# Altium schematic sheet Knapper og leds.SchDoc
size A4; SheetNumber: 1; SheetTotal: 1
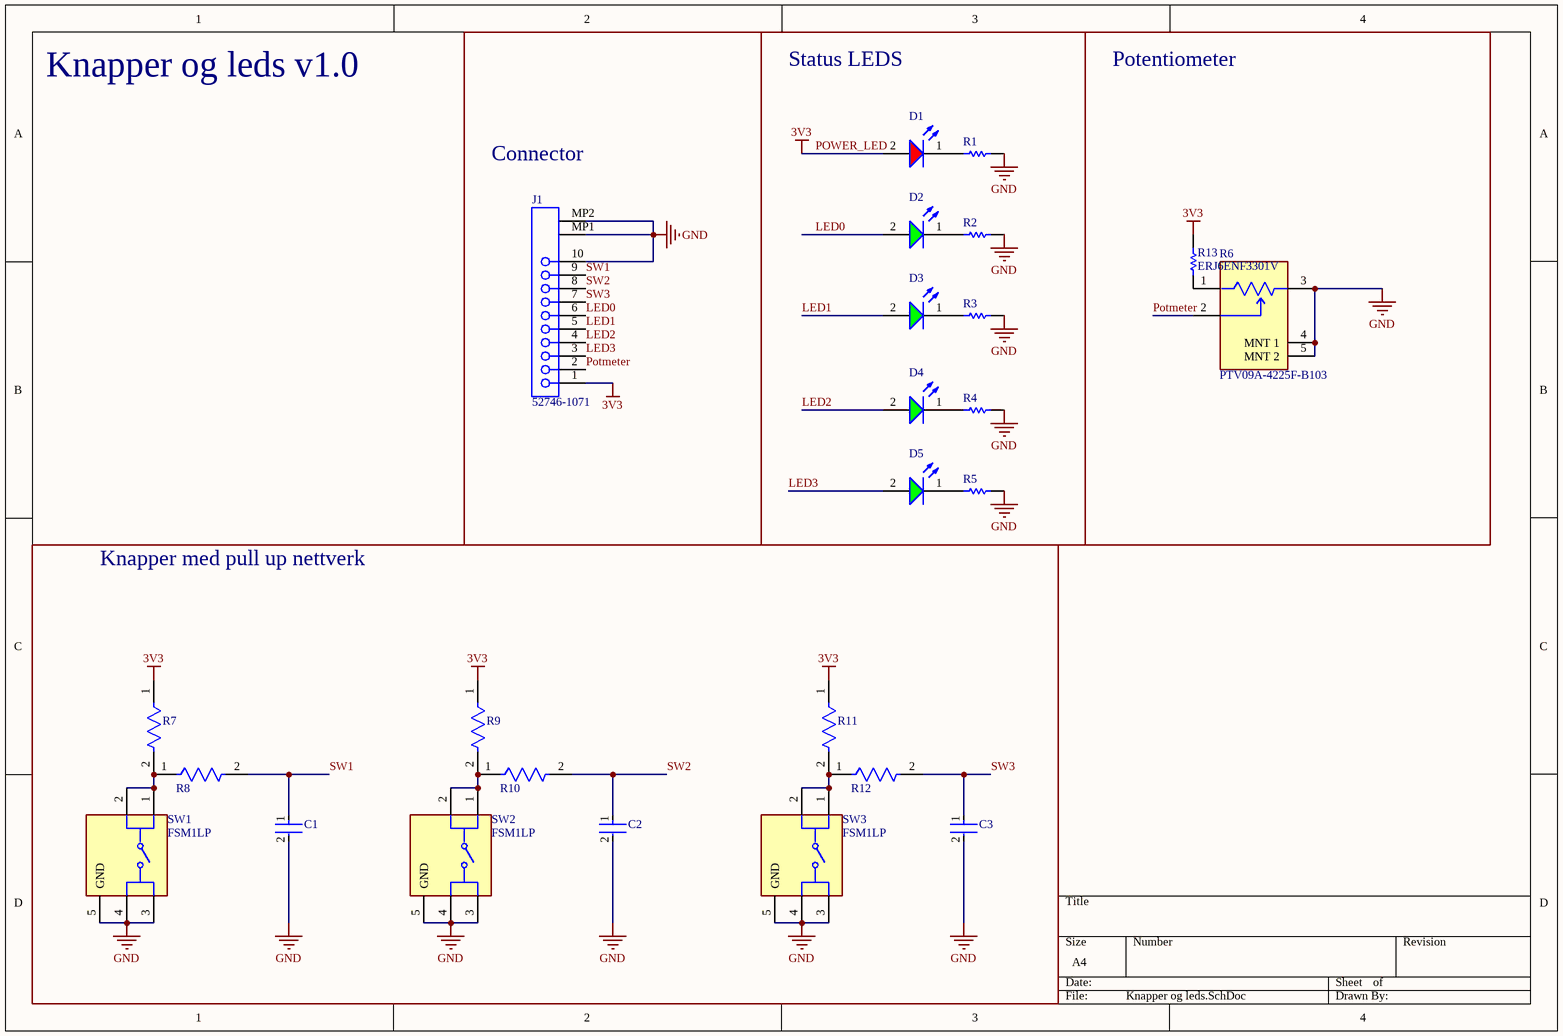
[diagram p0: Knapper og leds.SchDoc]

## Parts
C1  CC0805KRX7R7BB104  [FP-CC0805-0_85-MFG]  (value not drawn)
C2  CC0805KRX7R7BB104  [FP-CC0805-0_85-MFG]  (value not drawn)
C3  CC0805KRX7R7BB104  [FP-CC0805-0_85-MFG]  (value not drawn)
D1  150080SS75000  [WL-SMCW_0805_150080xx75000]  (value not drawn)
D2  150080VS75000  [WL-SMCW_0805_150080xx75000]  (value not drawn)
D3  150080VS75000  [WL-SMCW_0805_150080xx75000]  (value not drawn)
D4  150080VS75000  [WL-SMCW_0805_150080xx75000]  (value not drawn)
D5  150080VS75000  [WL-SMCW_0805_150080xx75000]  (value not drawn)
J1  52746-1071  [MOLX-52746-1071]
R1  ERJ6ENF56R0V  [RESC2013X70X40NL20T20]  (value not drawn)
R2  ERJ6ENF56R0V  [RESC2013X70X40NL20T20]  (value not drawn)
R3  ERJ6ENF56R0V  [RESC2013X70X40NL20T20]  (value not drawn)
R4  ERJ6ENF56R0V  [RESC2013X70X40NL20T20]  (value not drawn)
R5  ERJ6ENF56R0V  [RESC2013X70X40NL20T20]  (value not drawn)
R6  PTV09A-4225F-B103  [FP-PTV09A-4-MFG]
R7  CRCW080510K0FKEA  [FP-CRCW0805-e3-IPC_A]  (value not drawn)
R8  CRCW080510K0FKEA  [FP-CRCW0805-e3-IPC_A]  (value not drawn)
R9  CRCW080510K0FKEA  [FP-CRCW0805-e3-IPC_A]  (value not drawn)
R10  CRCW080510K0FKEA  [FP-CRCW0805-e3-IPC_A]  (value not drawn)
R11  CRCW080510K0FKEA  [FP-CRCW0805-e3-IPC_A]  (value not drawn)
R12  CRCW080510K0FKEA  [FP-CRCW0805-e3-IPC_A]  (value not drawn)
R13  ERJ6ENF3301V  [RESC2013X70X40ML20T20]
SW1  FSM1LP  [FP-FSM1LP-MFG]
SW2  FSM1LP  [FP-FSM1LP-MFG]
SW3  FSM1LP  [FP-FSM1LP-MFG]

## Blocks framed on the sheet
Connector: J1
Status LEDS: D1-D5 R1-R5
Potentiometer: R6 R13
Knapper med pull up nettverk: C1-C3 R7-R12 SW1-SW3

## Nets
GND: C1.2 C2.2 C3.2 J1.10 J1.MP1 J1.MP2 R1.2 R2.2 R3.2 R4.2 R5.2 R6.3 R6.4(MNT_1) R6.5(MNT_2) SW1.3 SW1.4 SW1.5(GND) SW2.3 SW2.4 SW2.5(GND) SW3.3 SW3.4 SW3.5(GND)
POWER_LED: D1.2(A) J1.1 R7.1 R9.1 R11.1 R13.2  [also labelled 3V3]
LED0: D2.2(A) J1.6
LED1: D3.2(A) J1.5
LED2: D4.2(A) J1.4
LED3: D5.2(A) J1.3
Potmeter: J1.2 R6.2
SW1: C1.1 J1.9 R8.2
SW2: C2.1 J1.8 R10.2
SW3: C3.1 J1.7 R12.2
NetD1_1: D1.1(K) R1.1
NetD2_1: D2.1(K) R2.1
NetD3_1: D3.1(K) R3.1
NetD4_1: D4.1(K) R4.1
NetD5_1: D5.1(K) R5.1
NetR6_1: R6.1 R13.1
NetR7_2: R7.2 R8.1 SW1.1 SW1.2
NetR9_2: R9.2 R10.1 SW2.1 SW2.2
NetR11_2: R11.2 R12.1 SW3.1 SW3.2

## Notes on the sheet
- Knapper og leds v1.0

## Library data of the parts
C1-C3 = CMP-1036-04402-6: CAP CER 0.1UF 16V X7R 0805; Manufacturer: Yageo; Material: Ceramic; Tolerance: 0.1; Capacitance: 100 nF; Value: 100 nF; Manufacturer Part Number: CC0805KRX7R7BB104; Temperature: -30°C to +85°C; Lead Free: Yes; Footprint Url: http://www.yageo.com/exep/pages/download/literatures/UPY-C_GEN_24.pdf; Voltage Rating: 16 V; Package: CC0805-0.85; RoHS: TRUE; Digikey Description: CAP CER 0.1UF 16V X7R 0805; Category: Cap; Octopart: https://octopart.com/cc0805krx7r7bb104-yageo-39467769; Device Class L3: Ceramic Capacitors; ComponentLink2URL: http://www.yageo.com/documents/recent/UPY-GPHC_Y5V_6.3V-to-50V_8.pdf; Temperature Range Low: -30°C; Mouser Description: Multilayer Ceramic Capacitors MLCC - SMD/SMT 100nF 16V X7R 10%; Automotive: No; Device Class L2: Capacitors; Height: 0.95mm; ComponentLink2Description: Datasheet; Temperature Characteristic: X7R; Ipc Land Pattern Name: CAPC200125X85; Device Class L1: Passive Components; Temperature Range High: +85°C
D1 = CMP-1426-00010-3: NexarPartId: 29717782; Peak Wavelength: 645nm; Luminous Intensity: 60mcd; Max Junction Temperature (Tj): 95°C; Wavelength: 630nm; Forward Current: 100mA; Max Reverse Voltage (DC): 5V; Color: Red; Lens Style: Clear, Rectangular; Test Current: 20mA; Power Dissipation: 72mW; Viewing Angle: 140°; Forward Voltage: 1.9V; Case Code (Metric): 2012; Max Operating Temperature: 85°C; Mount: Surface Mount; Height: 700µm; Case/Package: 0805; Min Operating Temperature: -40°C; Reverse Voltage: 5V; RoHS: Compliant; Packaging: Tape and Reel; REACH SVHC: Unknown; Case Code (Imperial): 0805; Length: 2mm; Width: 1.25mm; Dominant Wavelength: 630nm
D2-D5 = CMP-1426-00009-5: NexarPartId: 29717783; Color: Green; Dominant Wavelength: 570nm; Lens Style: Clear, Rectangular; Test Current: 20mA; Max Junction Temperature (Tj): 95°C; Max Reverse Voltage (DC): 5V; Forward Voltage: 2V; Forward Current: 100mA; Viewing Angle: 140°; Power Dissipation: 72mW; Peak Wavelength: 572nm; Luminous Intensity: 40mcd; Max Operating Temperature: 85°C; Case/Package: 0805; Case Code (Metric): 2012; RoHS: Compliant; Packaging: Tape and Reel; Min Operating Temperature: -40°C; Width: 1.25mm; Wavelength: 570nm; Mount: Surface Mount; Length: 2mm; REACH SVHC: Unknown; Height: 700µm; Case Code (Imperial): 0805; Reverse Voltage: 5V
J1 = CMP-1241-00372-1: 0.5 mm Pitch Easy-On(TM) Type FPC Connector, 2.0 mm Mated Height, Right Angle, ZIF, SMT, Bottom Contact, 10 Circuits, -20 to 85 degC, ELV and RoHS Compliant, Tape and Reel; Manufacturer: Molex; Polarized to PCB: Yes; Mated Height: 2.00mm; Material - Metal: Phosphor Bronze; PCB Locator: No; Entry Angle: 90degrees Angle; Material - Plating Mating: Gold; Pitch - Mating Interface: 0.50mm; Durability (mating cycles max): 20; Circuits (Loaded): 10; Current (Max per Contact): 0.5A; Voltage (Max): 50V; ComponentLink2URL: http://www.molex.com/webdocs/datasheets/pdf/en-us/0527461071_FFC_FPC_CONNECTORS.pdf; ComponentLink3Description: Package Specification; ComponentLink1Description: Manufacturer URL; ComponentLink1URL: http://www.molex.com/molex/index.jsp; PackageReference: 52746-1071; PackageDescription: 10-Lead FPC Connector, Pitch 0.5 mm; Number of Rows: 1; Material - Plating Termination: Gold; Contact Position: Bottom; ComponentLink2Description: Datasheet; PCB Retention: Yes; RoHS: TRUE; ComponentLink3URL: http://www.molex.com/pdm_docs/sd/527461071_sd.pdf; Packing: Tape and Reel; PackageVersion: Rev. H, 05/2009; PartNumber: 52746-1071; Stackable: No; Orientation: Right Angle; Mounting Technology: Surface Mount
R1-R5 = CMP-2001-00560-1: Manufacturer: Panasonic; Part Number: ERJ6ENF56R0V
R6 = CMP-07234-000052-1: POT 10K OHM 1/20W CARBON LINEAR; Power Rating: 50mW; Number of Gangs: 1; Hole Diameter: 9.1mm; Actuator Diameter: 0.236inch; Resistance Tolerance: 20%; Resistance: 10kR; Actuator Length: 0.984inch; Min Operating Temperature: -10°C; RoHS Compliant: Yes; Technology: CARBON FILM; Radiation Hardening: No; Taper: Linear; Military Standard: Not; Type: Potentiometer; Mount: Through Hole; Length: 11.4mm; Tolerance: 20%; Max Power Dissipation: 50mW; Max Operating Temperature: 50°C; Package Quantity: 100; Termination: PCB; Packaging: Bulk; Depth: 12.5mm; Resistor Type: Carbon; Number of Turns: 1; Series: Pro Audio PTV09; Height: 12.5mm; REACH SVHC: No SVHC
R7-R12 = CMP-2001-04908-2: RES Thick Film, 10kΩ, 1%, 0.125W, 100ppm/°C, 0805; Resistance: 10kR; Voltage Rating (DC): 150V; Power Rating: 125mW; Weight: 0.000194oz; Package Quantity: 5000; Military Standard: Not; Max Operating Temperature: 155°C; Temperature Coefficient: 100ppm/°C; Contact Plating: Tin; Width: 1.25mm; Height: 0.45mm; Radiation Hardening: No; Tolerance: 1%; Min Operating Temperature: -55°C; Voltage Rating: 150V; Length: 2mm; Depth: 1.25mm; Termination: SMD/SMT; Packaging: Tape and Reel; Case/Package: 0805; Case Code (Metric): 2012; Lead Free: Lead Free; Case Code (Imperial): 0805; Composition: Thick Film
R13 = CMP-2001-00533-1: Manufacturer: Panasonic; Part Number: ERJ6ENF3301V
SW1-SW3 = CMP-03402-000015-1: SWITCH TACTILE SPST-NO 0.05A 24V; Electrical Life: 100000Cycles; Actuator Type: Standard; Contact Resistance: 100mR; Current Rating: 50mA; Operating Force: 1.57N; Actuator Material: Polyphthalamide; Illumination Type: Non-Illuminated; Actuator Length: 0.01inch; Voltage Rating (DC): 12V; Throw Configuration: SPST; Switch Travel: 0.25mm; Switch Function: Off-Mom; Actuator Color: Black; Length: 6.19mm; Min Operating Temperature: -35°C; Contact Material: Copper Alloy; Max Current Rating: 50mA; Max Operating Temperature: 85°C; Packaging: Loose Piece; Lead Free: Lead Free; Mount: Surface Mount; RoHS Compliant: Yes; Orientation: Straight; Package Quantity: 2000; Mechanical Life: 100000Cycles; Type: Switch; ELV: Compliant; Depth: 8mm; Contact Plating: Silver; Max Voltage Rating (DC): 12V; REACH SVHC: No SVHC; Series: FSM1LP; Contact Current Rating: 50mA; Termination: Gull Wing